# Altium project CameraPCB.PrjPcb
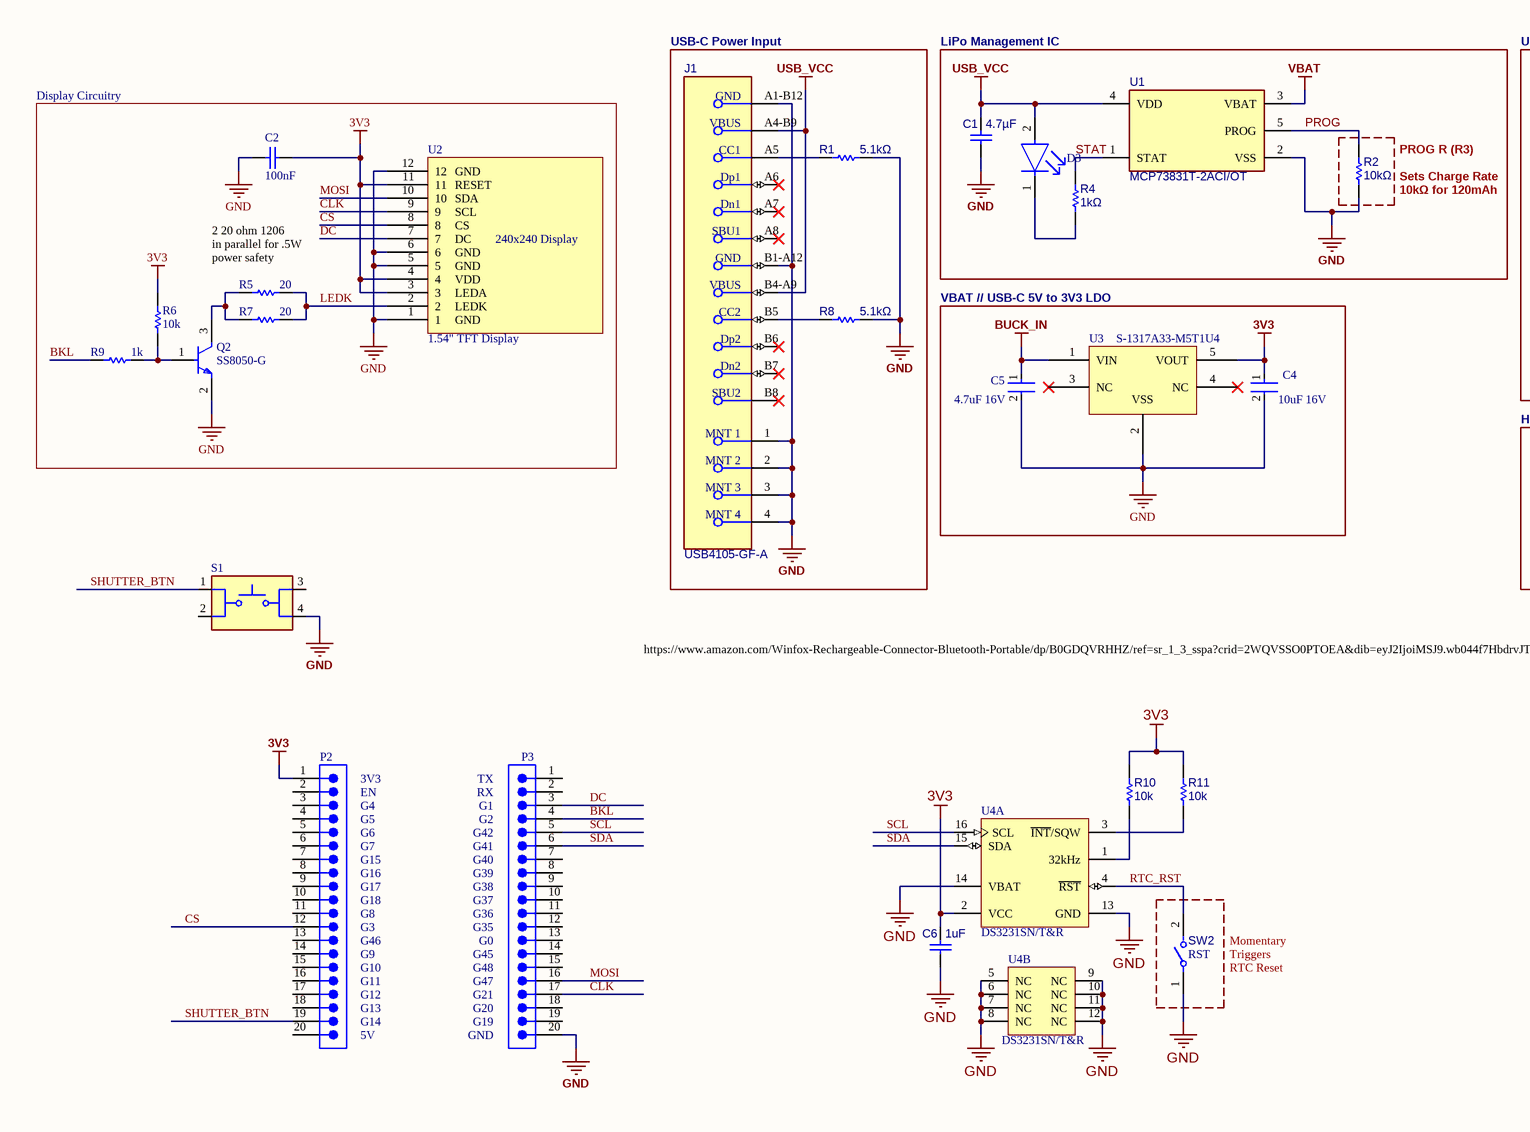
[diagram p0: Main.SchDoc, left]
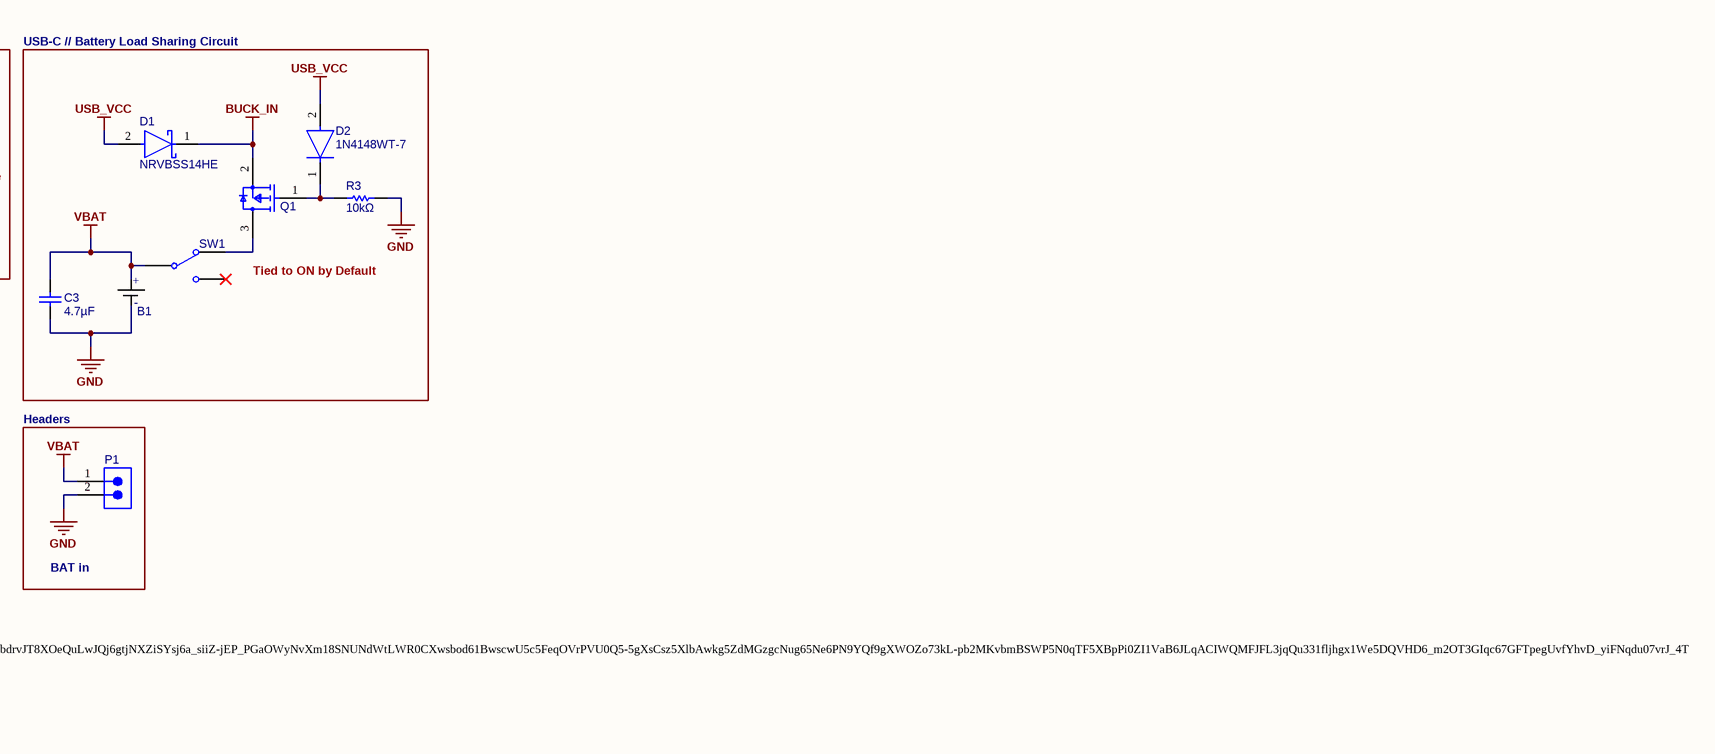
[diagram p1: Main.SchDoc, middle]
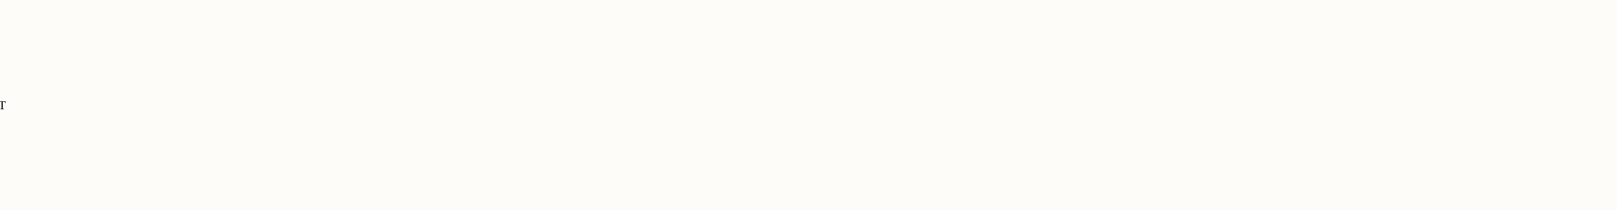
[diagram p2: Main.SchDoc, right]
1 sheet, 34 parts. Net scope: global (net labels, ports and power ports of the same name join across sheets).
Board file: Main.PcbDoc

## Sheet Main.SchDoc
size 381 x 241 mm; SheetNumber: 1; SheetTotal: 1

### Parts
B1  LiPo  (value not drawn)
C1  4.7µF  [WCAP-CSGP_0603_L1.6W0.8H0.8_Reflow]
C2  100nF  [CAPC1608X87X35NL15T15]
C3  4.7µF  [WCAP-CSGP_0603_L1.6W0.8H0.8_Reflow]
C4  10uF 16V  [FP-CC0603-DC-MFG]
C5  4.7uF 16V  [FP-CC0603-DA-MFG]
C6  1uF  [WCAP-CSGP_0603_L1.6W0.8H0.8_Reflow]
D1  NRVBSS14HE  [FP-477AD-MFG]
D2  1N4148WT-7  [FP-SOD523-MFG]
D3  LTST-C190KGKT  [FP-LTST-C190KGKT-MFG]  (value not drawn)
J1  USB4105-GF-A  [FP-USB4105-GF-A-MFG]
P1  61300211121  [61300211121]  (value not drawn)
P2  61302011121  [61302011121]  (value not drawn)
P3  61302011121  [61302011121]  (value not drawn)
Q1  IRLML6402TRPBF  [FP-Micro3-MFG]  (value not drawn)
Q2  SS8050-G  [FP-SS8050-G-MFG]
R1  5.1kΩ  [RESC1608X55X25NL10T15]
R2  10kΩ  [RESC1608X55X25NL10T15]
R3  10kΩ  [RESC1608X55X25NL10T15]
R4  1kΩ  [RESC1608X55X25NL10T15]
R5  20  [RESC3116X65X40NL10T20]
R6  10k  [RESC1608X55X25NL10T15]
R7  20  [RESC3116X65X40NL10T20]
R8  5.1kΩ  [RESC1608X55X25NL10T15]
R9  1k  [RESC1608X55X25NL10T15]
R10  10k  [RESC1608X55X25NL10T15]
R11  10k  [RESC1608X55X25NL10T15]
S1  SWT0325-073016TSK_REVA  [SW_SWT0325-073016TSK_REVA]  (value not drawn)
SW1  450404015514  [450404015514]  (value not drawn)
SW2  RST  [FP-B3U-1000P-B-MFG]
U1  MCP73831T-2ACI/OT  [FP-C04-091-OT-IPC_B]
U2  1.54" TFT Display  [PCBComponent_1]
U3  S-1317A33-M5T1U4  [S-1317A33-M5T1U4]
U4  DS3231SN/T&R  [W16-H2_N]  (parts A,B of 2)

### Blocks framed on the sheet
USB-C Power Input: J1 R1 R8
VBAT // USB-C 5V to 3V3 LDO: C4 C5 U3

### Nets
3V3: C2.1 C4.1 C6.2 P2.1 R6.2 R10.1 R11.1 U2.3 U2.4 U2.11 U3.5(VOUT) U4.2(VCC)
BUCK_IN: C5.1 D1.1(C) Q1.2(S) U3.1(VIN)
GND: B1.1(-) C1.1 C2.2 C3.1 C4.2 C5.2 C6.1 J1.1(MNT_1) J1.2(MNT_2) J1.3(MNT_3) J1.4(MNT_4) J1.A1-B12(GND) J1.B1-A12(GND) P1.2 P3.20 Q2.2(E) R1.1 R2.2 R3.2 R8.1 S1.4 SW2.1 U1.2(VSS) U2.1 U2.5 U2.6 U2.12 U3.2(VSS) U4.5(NC) U4.6(NC) U4.7(NC) U4.8(NC) U4.9(NC) U4.10(NC) U4.11(NC) U4.12(NC) U4.13(GND) U4.14(VBAT)
USB_VCC: C1.2 D1.2(A) D2.2(A) D3.2(A) J1.A4-B9(VBUS) J1.B4-A9(VBUS) U1.4(VDD)
VBAT: B1.0(+) C3.2 P1.1 SW1.COM U1.3(VBAT)
BKL: P3.4 R9.1
CLK: P3.17 U2.9
CS: P2.12 U2.8
DC: P3.3 U2.7
LEDK: R5.2 R7.2 U2.2
MOSI: P3.16 U2.10
PROG: R2.1 U1.5(PROG)
RTC_RST: SW2.2 U4.4(~{RST})
SCL: P3.5 U4.16(SCL)
SDA: P3.6 U4.15(SDA)
SHUTTER_BTN: P2.19 S1.1
STAT: R4.2 U1.1(STAT)
NetD2_1: D2.1(C) Q1.1(G) R3.1
NetD3_1: D3.1(C) R4.1
NetJ1_A5: J1.A5(CC1) R1.2
NetJ1_B5: J1.B5(CC2) R8.2
NetQ1_3: Q1.3(D) SW1.L1
NetQ2_1: Q2.1(B) R6.1 R9.2
NetQ2_3: Q2.3(C) R5.1 R7.1
NetR10_2: R10.2 U4.1(32kHz)
NetR11_2: R11.2 U4.3(~{INT}/SQW)

Not connected (* = marked no-connect by the designer): J1 A6(Dp1)* A7(Dn1)* A8(SBU1)* B6(Dp2)* B7(Dn2)* B8(SBU2)*; P2 2 3 4 5 6 7 8 9 10 11 13 14 15 16 17 18 20; P3 1 2 7 8 9 10 11 12 13 14 15 18 19; S1 2 3; SW1 L2*; U3 3(NC)* 4(NC)*

### Notes on the sheet
- LiPo Management IC
- USB-C // Battery Load Sharing Circuit
- Display Circuitry
- (near R2) PROG R (R3)
- (near R2) Sets Charge Rate
- (near R2) 10kΩ for 120mAh
- 2 20 ohm 1206
- (near R5) in parallel for .5W
- (near R5) power safety
- Tied to ON by Default
- Headers
- BAT in
- https://www.amazon.com/Winfox-Rechargeable-Connector-Bluetooth-Portable/dp/B0GDQVRHHZ/ref=sr_1_3_sspa?crid=2WQVSSO0PTOEA&dib=eyJ2IjoiMSJ9.wb044f7HbdrvJT8XOeQuLwJQj6gtjNXZiSYsj6a_siiZ-jEP_PGaOWyNvXm18SNUNdWtLWR0CXwsbod61BwscwU5c5FeqOVrPVU0Q5-5gXsCsz5XlbAwkg5ZdMGzgcNug65Ne6PN9YQf9gXWOZo73kL-pb2MKvbmBSWP5N0qTF5XBpPi0ZI1VaB6JLqACIWQMFJFL3jqQu331fljhgx1We5DQVHD6_m2OT3GIqc67GFTpegUvfYhvD_yiFNqdu07vrJ_4Tvq0GegV5Nk6r0zMqyPAi2_Xop_wOX4z9heR48.H_-ZXW_Ep34HBHr069QhnVln8iDr47g2u9IaVgDiXb8&dib_tag=se&keywords=lipo%2Bbattery&qid=1788032604&sprefix=lipo%2Bbatter%2Caps%2C253&sr=8-3-spons&sp_csd=d2lkZ2V0TmFtZT1zcF9hdGY&th=1
- (near P2) 3V3
- (near P2) EN
- (near P2) G4
- (near P2) G5
- (near P2) G6
- (near P3) TX
- (near P3) RX
- (near P3) G1
- (near P3) G2
- (near P3) G42
- (near P2) G7
- (near P2) G15
- (near P2) G16
- (near P2) G17
- (near P2) G18
- (near P3) G41
- (near P3) G40
- (near P3) G39
- (near P3) G38
- (near P3) G37
- (near P2) G8
- (near P2) G3
- (near P2) G46
- (near P2) G9
- (near P2) G10
- (near P3) G36
- (near P3) G35
- (near P3) G0
- (near P3) G45
- (near P3) G48
- (near SW2) Momentary
- (near SW2) Triggers
- (near SW2) RTC Reset
- (near P2) G11
- (near P2) G12
- (near P2) G13
- (near P2) G14
- (near P2) 5V
- (near P3) G47
- (near P3) G21
- (near P3) G20
- (near P3) G19
- (near P3) GND
- (in symbol 1.54" TFT Display) GND; RESET; SDA; SCL; CS; DC; 240x240 Display; VDD; LEDA; LEDK

### Library data of the parts
B1 = 3.7V 30mAh LiPo
C1 C3 C6 = CMP-207839-000060-3
C2 = CMP-2006-03301-1
C4 = CMP-00621-81932632-1: CM105X5R106K16AT; Capacitance: 10µF; Dielectric: X5R; Material: Ceramic; Tolerance: 10%; NexarPartId: 81932632; Height: 1mm; Halogen Free: Halogen Free; Voltage Rating: 16V; Max Operating Temperature: 85°C; Voltage Rating (DC): 16V; Lead Free: Lead Free; RoHS: Non-Compliant; Min Operating Temperature: -55°C; Case/Package: 0603
C5 = CMP-03422-001236-1: GRM188Z71C475KE21D; Manufacturer: YAGEO; Manufacturer Part Number: CC0603KRX5R7BB475; Temperature Characteristic: X5R; Temperature Coefficient: 15%; Material: Ceramic; Tolerance: 0.1; Footprint Url: http://www.yageo.com/exep/pages/download/literatures/UPY-C_GEN_24.pdf; Device Class L3: Ceramic Capacitors; Category: Cap; Voltage Rating: 16 V; Automotive: No; Temperature Range High: +125°C; Value: 4.7 uF; Device Class L1: Passive Components; RoHS: TRUE; Device Class L2: Capacitors; Voltage: 16 V; Height: 0.9mm; Temperature Range Low: -55°C; Temperature: -55°C to +125°C; Capacitance: 4.7 uF; Mouser Description: Multilayer Ceramic Capacitors MLCC - SMD/SMT 4.7uF 16V X5R 10%; Octopart: https://octopart.com/cc0603krx5r7bb475-yageo-34978295; Package: CC0603-DA; Lead Free: Yes; Digikey Description: CAP CER 4.7UF 16V X5R 0603
D1 = CMP-00278-93203856-2: NRVBSS14HE Rectifier Diode, Schottky, 1 Phase, 1 Element, 1A, 40V V(RRM), Silicon; Manufacturer Lifecycle Status: ACTIVE; Capacitance: 55pF; Max Forward Surge Current (Ifsm): 25A; Peak Reverse Current: 5µA; Max Junction Temperature (Tj): 150°C; Forward Current: 1A; Min Operating Temperature: -55°C; NexarPartId: 93203856; Reverse Voltage: 40V; Max Operating Temperature: 150°C; RoHS: Compliant; Lifecycle Status: Production; Max Repetitive Reverse Voltage (Vrrm): 40V; Height: 750µm
D2 = CMP-2000-05518-3: DIODE GEN PURP 80V 125MA SOD523; Power Rating: 150mW; Peak Non-Repetitive Surge Current: 2A; Forward Voltage: 1.25V; Reverse Recovery Time: 4ns; Peak Reverse Current: 1uA; Max Repetitive Reverse Voltage (Vrrm): 100V; Capacitance: 2pF; Polarity: Standard; Element Configuration: Single; Forward Current: 250mA; Lead Free: Lead Free; Packaging: Tape and Reel; Length: 0.9mm; Min Operating Temperature: -65°C; Current Rating: 125mA; Max Reverse Voltage (DC): 80V; Width: 1.3mm; Package Quantity: 3000; Output Current: 125mA; Power Dissipation: 150mW; Max Operating Temperature: 150°C; Radiation Hardening: No; Average Rectified Current: 125mA; Height: 0.65mm; Voltage Rating (DC): 80V; Max Surge Current: 2A; Weight: 3.5E-05oz; Recovery Time: 4ns; Max Forward Surge Current (Ifsm): 2A; Contact Plating: Tin; Number of Pins: 2; Mount: Surface Mount; REACH SVHC: No SVHC
D3 = CMP-2000-05197-2: LED GREEN CLEAR CHIP SMD; Test Current: 20mA; Power Rating: 75mW; Forward Voltage: 2V; Wavelength: 574nm; Number of LEDs: 1; Reverse Voltage: 5V; Dominant Wavelength: 571nm; Lens Style: Diffused; Luminous Intensity: 35mcd; Forward Current: 30mA; Viewing Angle: 130°; Lens Color: Colorless; Width: 0.8mm; Case Code (Imperial): 0603; Case Code (Metric): 1608; Number of Pins: 2; Radiation Hardening: No; Package Quantity: 1; Lead Free: Lead Free; Lens Transparency: Clear; Depth: 0.8mm; Power Dissipation: 75mW; Mount: Surface Mount; Max Operating Temperature: 85°C; Case/Package: 0603; Height: 0.8mm; Illumination Color: Green; Color: Green; Length: 1.6mm; Packaging: Tape and Reel; Number of Elements: 1; Min Operating Temperature: -55°C
J1 = CMP-245163-000001-1: CONN RCPT USB2.0 TYPEC 5A; Manufacturer: GCT; Voltage Rating: 20V; Is Female: yes; Current Rating: 5/6.25/1.25/0.25A; Number Of Contacts: 16; Conn Orientation: Right Angle; Device Class L1: Connectors; Category: Conn; Lead Free: Yes; RoHS: TRUE; Temperature Range High: +85°C; Digikey Description: CONN RCPT USB2.0 TYPEC 5A; Device Class L3: unset; ComponentLink2Description: Datasheet; Manufacturer Part Number: USB4105-GF-A; Package: 0; Usb Standard: USB 2.0; Device Class L2: USB Connectors; Automotive: No; Temperature Range Low: -40°C; Height: 3.46mm; Temperature: -40°C to +85°C; Contact Material: Gold,Nickel; ComponentLink2URL: https://gct.co/files/drawings/usb4105.pdf; Octopart: https://octopart.com/usb4105-gf-a-gct-106627878
P1 = CMP-1712-00002-6: NexarPartId: 20081794; Number of Contacts: 2; Pitch: 2.54mm; Connector Type: Male Pin; Voltage Rating: 250V; Current Rating: 3A; Gender: Male; Contact Resistance: 20mΩ; Height: 8.94mm; Lead Free: Lead Free; Number of Pins: 2; Termination: Through Hole; RoHS: Compliant; Lead Pitch: 2.54mm; REACH SVHC: No SVHC; Housing Material: PBT; Contact Mating Length: 5.9944mm; Min Operating Temperature: -40°C; Orientation: Vertical; Contact Material: Copper; Contact Gender: Male; Max Operating Temperature: 125°C; Number of Rows: 1; Number of Positions: 2; Packaging: Bulk; Contact Plating: Gold; Mount: Through Hole; Color: Black; Operating Supply Voltage: 250V
P2 P3 = CMP-1502-01102-4: THT Vertical Pin Header WR-PHD, Pitch 2.54 mm, Single Row, 20 pins; Current Rating: 3A; Contact Resistance: 20mΩ; Operating Supply Voltage: 250V; Gender: Male; Connector Type: Male Pin; Number of Positions: 20; Pitch: 2.54mm; Contact Mating Length: 5.9944mm; Contact Plating: Gold; Termination: Solder; RoHS: Compliant; Mount: Through Hole; Contact Material: Copper; Orientation: Vertical; Color: Black; Number of Rows: 1; Number of Pins: 20; Number of Contacts: 20; Lead Pitch: 2.54mm; Packaging: Bulk
Q1 = CMP-32901-000130-1: MOSFET P-CH 20V 3.7A SOT-23; Manufacturer: Infineon; Reverse Recovery Time: 29ns; Max Forward Diode Voltage: -1.2V; Input Capacitace At Vds: 633pF @ -10V; Drain To Source Resistance: 0.05Ω; Gate To Source Voltage: 12V; Max Junction Temp: +150°C; Pulse Drain Current: -22A; Threshold Vgs Min: -0.4V; Turn Off Delay Time: 588ns; Number Of Channels: 1; Power Dissipation: 1.3W; Turn On Delay Time: 350ns; Drain To Source Breakdown Voltage: -20V; Continuous Drain Current: -3.7A; Depletion Mode: False; Gate Charge At Vgs: 8nC @ -5V; Rthja Max: 75°C/W; Threshold Vgs: -0.55V; Standoff Height: 0.01mm; Reverse Recovery Charge: 11nC; Device Class L2: Transistors; Ipc Land Pattern Name: SOT95P237X100-3; Temperature Range High: +150°C; Octopart: https://octopart.com/irlml6402trpbf-infineon-65874989; ComponentLink2URL: https://www.infineon.com/dgdl/irlml6402pbf.pdf?fileId=5546d462533600a401535668d5c2263c; Automotive: No; Manufacturer Part Number: IRLML6402TRPBF; Height: 1.12mm; Drain To Source Voltage: -20V; Digikey Description: MOSFET P-CH 20V 3.7A SOT-23; Device Class L1: Discrete Semiconductors; Package: Micro3; Lead Free: Yes; Temperature Range Low: -55°C; Number Of P Channels: 1; Technology: MOSFET; Temperature: -55°C to +150°C; Category: Trans; Footprint Url: http://irf.com/package/outline/po_micro3.pdf; RoHS: TRUE; Device Class L3: MOSFETs; Threshold Vgs Max: -1.2V; ComponentLink2Description: Datasheet
Q2 = CMP-20235-000001-1: NPN TRANSISTOR 1.5A 40V SOT-23 R; Transition Frequency: 100MHz; Max Breakdown Voltage: 25V; Collector Emitter Voltage (VCEO): 400mV; Max Power Dissipation: 300mW; Max Collector Current: 1.5A; Case/Package: TO-236-3; Packaging: Tape and Reel; RoHS Compliant: Yes; Mount: Surface Mount; Collector Emitter Breakdown Voltage: 25V
R1-R4 R8 R10 R11 = CMP-2000-04186-1
R5 R7 = CMP-2003-03957-1: Manufacturer: Yageo; Part Number: RC1206JR-0720RL
R6 R9 = CMP-2000-04525-1: Part Number: RT0603BRE071KL; Manufacturer: Yageo
S1 = SWT0325-073016TSK_REVA: 6mm x 6mm Through Hole Tactile Switch; MF: Global Connector Technology; SnapEDA_Link: https://www.snapeda.com/parts/SWT0325-073016TSK/Global+Connector+Technology/view-part/?ref=snap; Package: None; Value: *; MP: SWT0325-073016TSK; Check_prices: https://www.snapeda.com/parts/SWT0325-073016TSK/Global+Connector+Technology/view-part/?ref=eda
SW1 = CMP-03913-99472344-1: 450404015514 Slide Switch, 0.3A, 5Vdc, Smd Rohs Compliant: Yes; Current Rating: 300mA; Insulation Resistance: 100MΩ; Voltage Rating: 5V; NexarPartId: 99472344; Min Operating Temperature: -40°C; Contact Plating: Silver; Packaging: Tape and Reel; Max Operating Temperature: 85°C; RoHS: Compliant
SW2 = CMP-08834-000005-1: SWITCH TACTILE SPST-NO 0.05A 12V; Manufacturer Part Number: B3U-1000P-B; Manufacturer: Omron; Operating Force: 1.5N; Contact Current Rating: 50mA; Contact Resistance: 100mΩ; Electromechanical Life: 200000Cycles; Height: 1.75mm; Device Class L2: Switches; Temperature Range High: +70°C; Digikey Description: SWITCH TACTILE SPST-NO 0.05A 12V; Throw Configuration: SPST-NO; Ambient Temperature Range High: +70°C; Temperature: -25°C to +70°C; Lead Free: Yes; ComponentLink2URL: https://omronfs.omron.com/en_US/ecb/products/pdf/en-b3u.pdf; Device Class L3: Tactile Switches; Ambient Temperature Range Low: -25°C; Mount: Surface Mount; Automotive: No; Mouser Description: Tactile Switches Top Actuated with boss w/o ground; Octopart: https://octopart.com/b3u-1000p-b-omron-1057356; RoHS: TRUE; Package: 0; Device Class L1: Electromechanical; Voltage Rating Dc: 12V; Category: Switch; Temperature Range Low: -25°C; ComponentLink2Description: Datasheet
U1 = CMP-0133-00143-2: IC CONTROLLR LI-ION 4.2V SOT23-5; Max Power Dissipation: 1.54W; Output Current: 500mA; Max Output Voltage: 4.5V; Number of Outputs: 1; Min Output Voltage: 4.168V; Min Supply Voltage: 3.75V; Max Input Voltage: 6V; Voltage Rating: 4.534V; Drain to Source Resistance: 350mR; Max Operating Temperature: 85°C; Length: 0.122inch; Number of Pins: 5; REACH SVHC: No SVHC; Radiation Hardening: No; Min Operating Temperature: -40°C; Weight: 0.00709oz; Contact Plating: Tin; Termination: SMD/SMT; Case/Package: SOT-23; Mount: Surface Mount; Width: 0.071inch; Packaging: Tape and Reel; Number of Cells: 1; Max Charge Current: 500mA; Height: 0.051inch; Number of Channels: 1; Output Voltage: 4.2V; Max Supply Voltage: 6V; Lead Free: Lead Free
U4 = CMP-0254-00377-1: Extremely Accurate I2C-Integrated Real-Time Clock/TCXO/Crystal, 16-Pin SO, -40 to 85 degC, Reel; PackageReference: W16-H2; DatasheetVersion: Rev 8, Jul-2010; ComponentLink1URL: http://www.maxim-ic.com; ComponentLink1Description: Manufacturer URL; ComponentLink2URL: http://datasheets.maxim-ic.com/en/ds/DS3231.pdf; ComponentLink3Description: Package Specification; ComponentLink2Description: Datasheet; Code_JEDEC: MS-013-AA; PackageVersion: revD, 2010; Code_IPC: SOIC127P1030-16; ComponentLink3URL: http://pdfserv.maxim-ic.com/package_dwgs/21-0042.PDF; PackageDescription: 16-Pin Small-Outline IC, Wide (0.3in), 1.27 mm Pitch, SOIC (W)